# Altium schematic sheet DB10011_Converter.SchDoc: Power converters
size A3; Engineer: Danny Bokma; Revision: V0.3; SheetNumber: 3; SheetTotal: 7
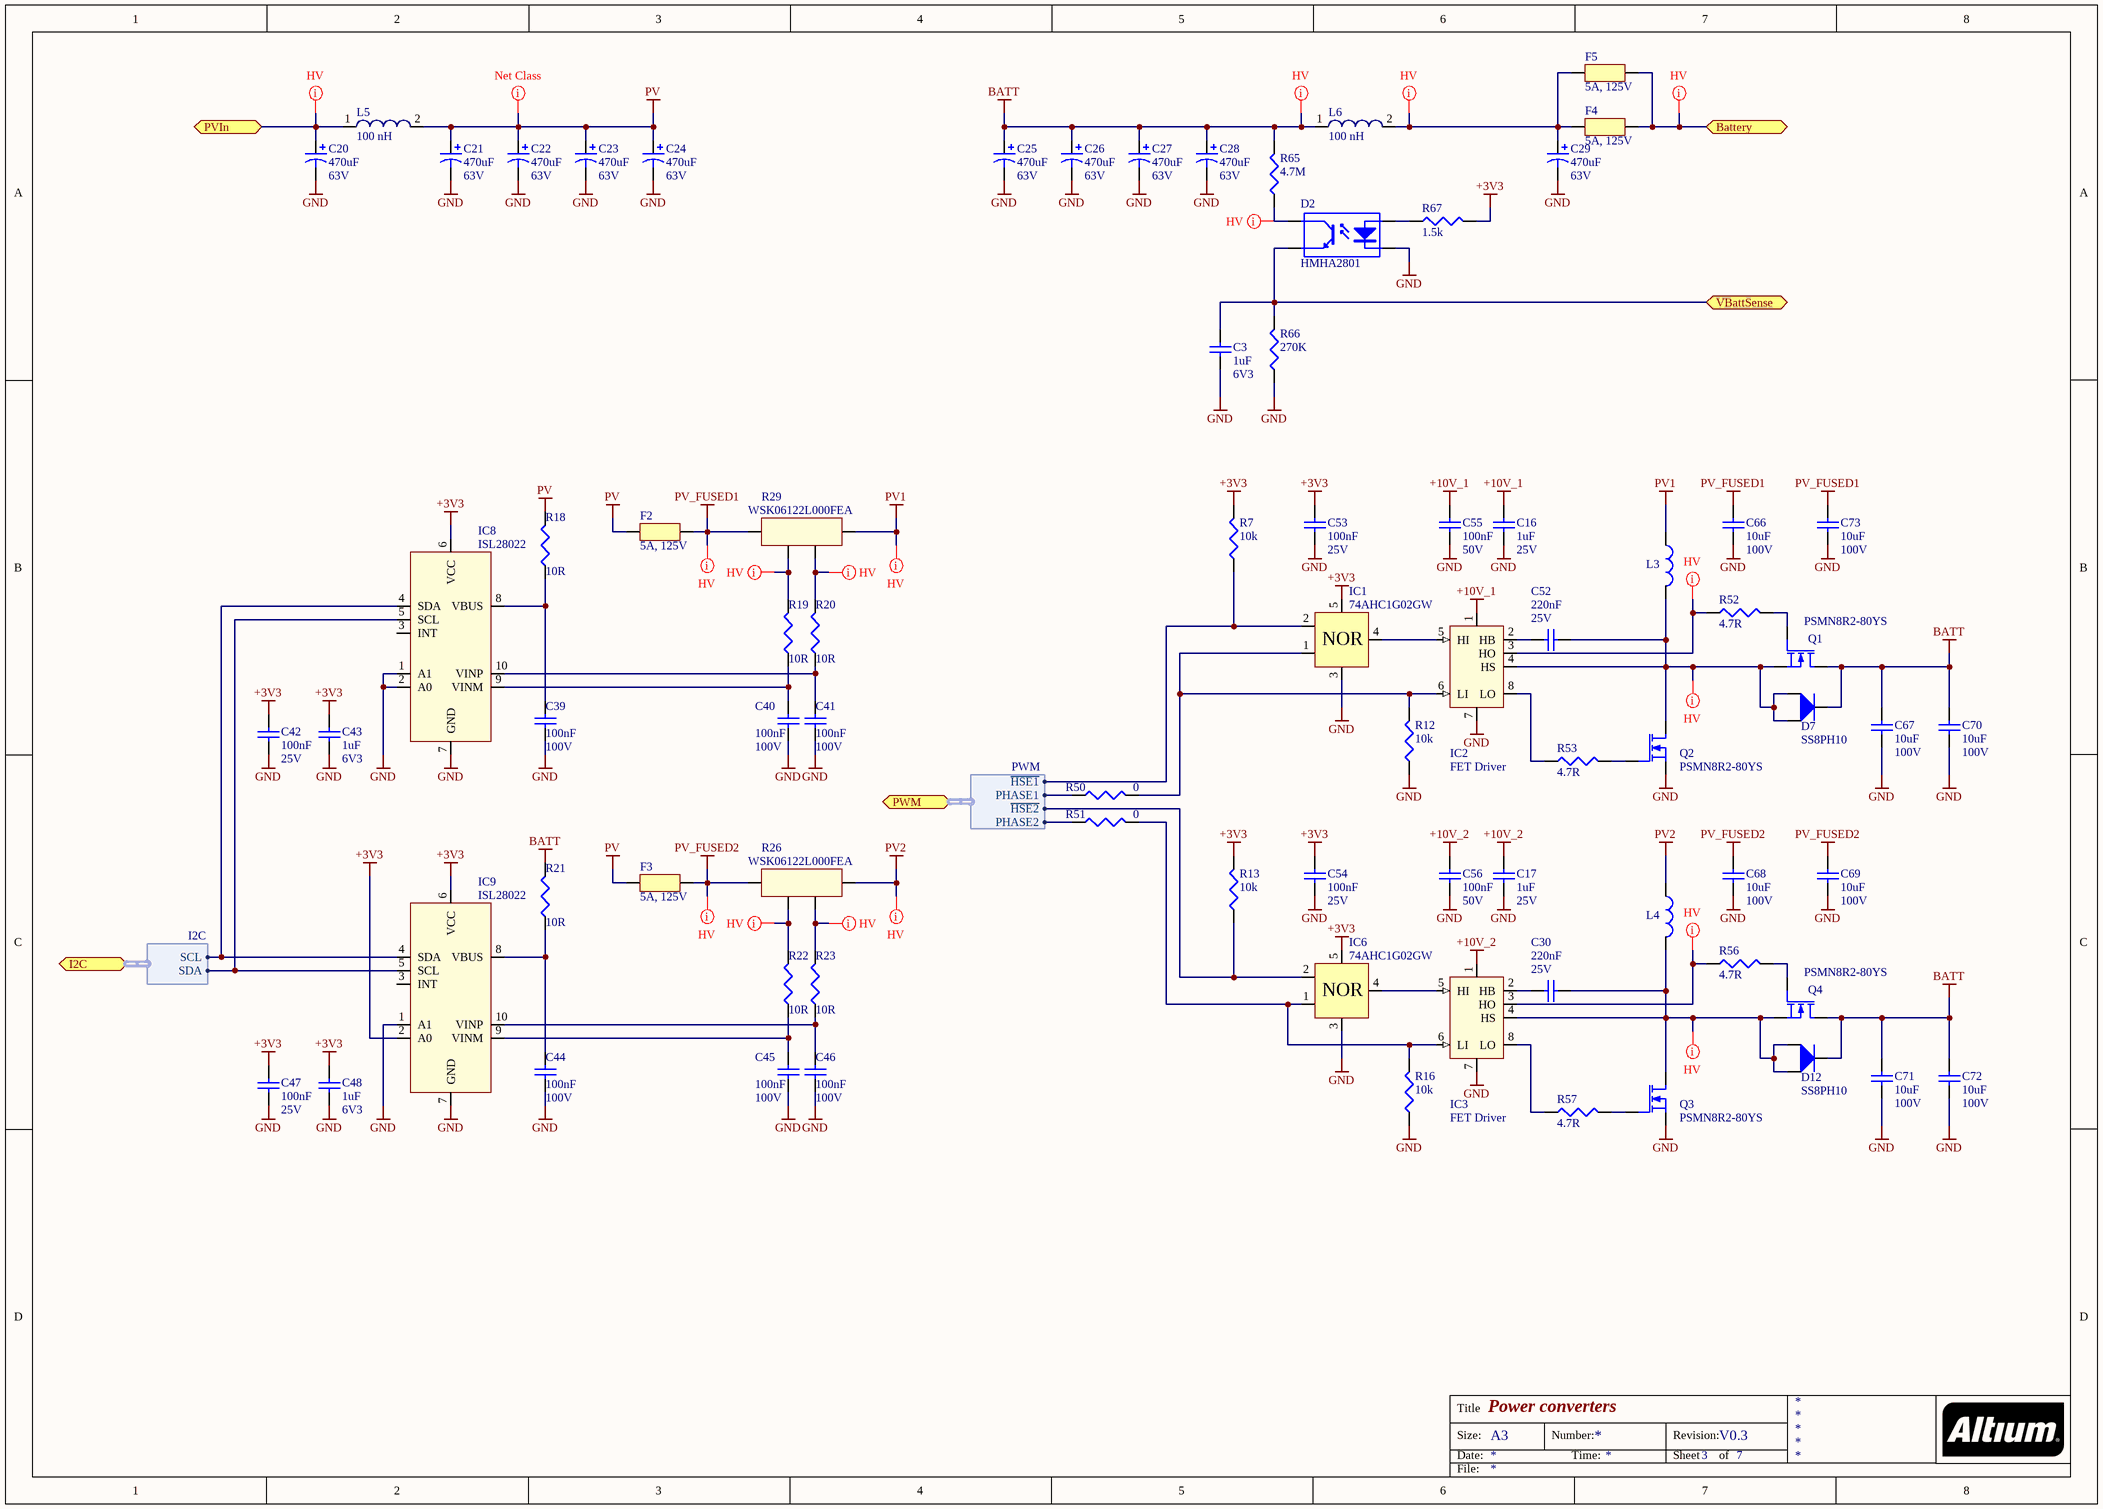
[diagram p0: DB10011_Converter.SchDoc]

## Parts
C3  1uF  Voltage Rating: 6V3  [C0402]
C16  1uF  Voltage Rating: 25V  [C0603]
C17  1uF  Voltage Rating: 25V  [C0603]
C20  470uF  Voltage Rating: 63V  [Radial-16]
C21  470uF  Voltage Rating: 63V  [Radial-16]
C22  470uF  Voltage Rating: 63V  [Radial-16]
C23  470uF  Voltage Rating: 63V  [Radial-16]
C24  470uF  Voltage Rating: 63V  [Radial-16]
C25  470uF  Voltage Rating: 63V  [Radial-16]
C26  470uF  Voltage Rating: 63V  [Radial-16]
C27  470uF  Voltage Rating: 63V  [Radial-16]
C28  470uF  Voltage Rating: 63V  [Radial-16]
C29  470uF  Voltage Rating: 63V  [Radial-16]
C30  220nF  Voltage Rating: 25V  [C0603]
C39  100nF  Voltage Rating: 100V  [C-0805]
C40  100nF  Voltage Rating: 100V  [C-0805]
C41  100nF  Voltage Rating: 100V  [C-0805]
C42  100nF  Voltage Rating: 25V  [C0402]
C43  1uF  Voltage Rating: 6V3  [C0402]
C44  100nF  Voltage Rating: 100V  [C-0805]
C45  100nF  Voltage Rating: 100V  [C-0805]
C46  100nF  Voltage Rating: 100V  [C-0805]
C47  100nF  Voltage Rating: 25V  [C0402]
C48  1uF  Voltage Rating: 6V3  [C0402]
C52  220nF  Voltage Rating: 25V  [C0603]
C53  100nF  Voltage Rating: 25V  [C0402]
C54  100nF  Voltage Rating: 25V  [C0402]
C55  100nF  Voltage Rating: 50V  [C0603]
C56  100nF  Voltage Rating: 50V  [C0603]
C66  10uF  Voltage Rating: 100V  [C2220]
C67  10uF  Voltage Rating: 100V  [C2220]
C68  10uF  Voltage Rating: 100V  [C2220]
C69  10uF  Voltage Rating: 100V  [C2220]
C70  10uF  Voltage Rating: 100V  [C2220]
C71  10uF  Voltage Rating: 100V  [C2220]
C72  10uF  Voltage Rating: 100V  [C2220]
C73  10uF  Voltage Rating: 100V  [C2220]
D2  HMHA2801  [FSOP4]
D7  SS8PH10  [TO277A]
D12  SS8PH10  [TO277A]
F2  5A, 125V  [SMF]
F3  5A, 125V  [SMF]
F4  5A, 125V  [SMF]
F5  5A, 125V  [SMF]
IC1  74AHC1G02GW  [SOT-23-5]
IC2  FET Driver  [SO-8]
IC3  FET Driver  [SO-8]
IC6  74AHC1G02GW  [SOT-23-5]
IC8  ISL28022  [MSOP10]
IC9  ISL28022  [MSOP10]
L3  ETD39Custom  [ETD39]  (value not drawn)
L4  ETD39Custom  [ETD39]  (value not drawn)
L5  100 nH  [WE-HCM 1240]
L6  100 nH  [WE-HCM 1240]
Q1  PSMN8R2-80YS  [SOT-669]
Q2  PSMN8R2-80YS  [SOT-669]
Q3  PSMN8R2-80YS  [SOT-669]
Q4  PSMN8R2-80YS  [SOT-669]
R7  10k  [0402]
R12  10k  [0402]
R13  10k  [0402]
R16  10k  [0402]
R18  10R  [0603]
R19  10R  [0603]
R20  10R  [0603]
R21  10R  [0603]
R22  10R  [0603]
R23  10R  [0603]
R26  WSK06122L000FEA  [WSK0612]
R29  WSK06122L000FEA  [WSK0612]
R50  0  [0402]
R51  0  [0402]
R52  4.7R  [0603]
R53  4.7R  [0603]
R56  4.7R  [0603]
R57  4.7R  [0603]
R65  4.7M  [0805]
R66  270K  [0402]
R67  1.5k  [0402]

## Ports
Battery, I2C (harness I2C), PVIn, PWM (harness PWM), VBattSense

## Harnesses
PWM: PHASE2, PHASE1, ~{HSE1}, ~{HSE2}
I2C: SDA, SCL

## Nets
+3V3: C42.2 C43.2 C47.2 C48.2 C53.1 C54.1 IC1.5(VCC) IC6.5(VCC) IC8.6(VCC) IC9.2(A0) IC9.6(VCC) R7.2 R13.2 R67.2
+10V_1: C16.2 C55.1 IC2.1(VDD)
+10V_2: C17.2 C56.1 IC3.1(VDD)
BATT: C25.1 C26.1 C27.1 C28.1 C67.2 C70.2 C71.2 C72.2 D7.K D12.K L6.1 Q1.D Q4.D R21.2 R65.2
GND: C3.1 C16.1 C17.1 C20.2 C21.2 C22.2 C23.2 C24.2 C25.2 C26.2 C27.2 C28.2 C29.2 C39.1 C40.1 C41.1 C42.1 C43.1 C44.1 C45.1 C46.1 C47.1 C48.1 C53.2 C54.2 C55.2 C56.2 C66.1 C67.1 C68.1 C69.1 C70.1 C71.1 C72.1 C73.1 D2.2(K1) IC1.3(GND) IC2.7(VSS) IC3.7(VSS) IC6.3(GND) IC8.1(A1) IC8.2(A0) IC8.7(GND) IC9.1(A1) IC9.7(GND) Q2.S Q3.S R12.1 R16.1 R66.1
PV: C21.1 C22.1 C23.1 C24.1 F2.1 F3.1 L5.2 R18.2
PV1: L3.1 R29.a
PV2: L4.1 R26.a
PV_FUSED1: C66.2 C73.2 F2.2 R29.b
PV_FUSED2: C68.2 C69.2 F3.2 R26.b
Battery: F4.2 F5.2 ; port Battery
PVIn: C20.1 L5.1 ; port PVIn
VBattSense: C3.2 D2.3(E1) R66.2 ; port VBattSense
NetC29_1: C29.1 F4.1 F5.1 L6.2
NetC30_1: C30.1 D12.1(A) D12.2(A) IC3.4(HS) L4.2 Q3.D Q4.S
NetC30_2: C30.2 IC3.2(HB)
NetC39_2: C39.2 IC8.8(VBUS) R18.1
NetC40_2: C40.2 IC8.9(VINM) R19.1
NetC41_2: C41.2 IC8.10(VINP) R20.1
NetC44_2: C44.2 IC9.8(VBUS) R21.1
NetC45_2: C45.2 IC9.9(VINM) R22.1
NetC46_2: C46.2 IC9.10(VINP) R23.1
NetC52_1: C52.1 D7.1(A) D7.2(A) IC2.4(HS) L3.2 Q1.S Q2.D
NetC52_2: C52.2 IC2.2(HB)
NetD2_1: D2.1(A1) R67.1
NetD2_4: D2.4(C1) R65.1
NetIC1_1: IC1.1(B) IC2.6(LI) R12.2 R50.2
NetIC1_2: IC1.2(A) R7.1 ; port PWM.~{HSE1}
NetIC1_4: IC1.4(Y) IC2.5(HI)
NetIC2_3: IC2.3(HO) R52.1
NetIC2_8: IC2.8(LO) R53.1
NetIC3_3: IC3.3(HO) R56.1
NetIC3_5: IC3.5(HI) IC6.4(Y)
NetIC3_6: IC3.6(LI) IC6.1(B) R16.2 R51.2
NetIC3_8: IC3.8(LO) R57.1
NetIC6_2: IC6.2(A) R13.1 ; port PWM.~{HSE2}
NetIC8_4: IC8.4(SDA) IC9.4(SDA) ; port I2C.SCL
NetIC8_5: IC8.5(SCL) IC9.5(SCL) ; port I2C.SDA
NetQ1_G: Q1.G R52.2
NetQ2_G: Q2.G R53.2
NetQ3_G: Q3.G R57.2
NetQ4_G: Q4.G R56.2
NetR19_2: R19.2 R29.bs
NetR20_2: R20.2 R29.as
NetR22_2: R22.2 R26.bs
NetR23_2: R23.2 R26.as
NetR50_1: R50.1 ; port PWM.PHASE1
NetR51_1: R51.1 ; port PWM.PHASE2

Not connected (* = marked no-connect by the designer): IC8 3(INT); IC9 3(INT)

## Layout directives
net class 0.5mm: BATT, Battery, NetC29_1, NetC30_1, NetC52_1, NetD2_4, NetIC2_3, NetIC3_3, NetR19_2, NetR20_2, NetR22_2, NetR23_2, PV, PV1, PV2, PV_FUSED1, PV_FUSED2, PVIn

## Notes on the sheet
- Title
- Size:
- Date:
- A3
- Number:
- Time:
- Revision:
- Sheet
- of
- File:
- (in symbol 74AHC1G02GW) NOR

## Library data of the parts
C3 C43 C48 = 1uF/0402/CER/6.3V: Capacitor, 1uF, 6.3V, X5R; Capacitance Tolerance: ± 10%; Capacitor Case Style: 0402; Brand Number: 04026D105KAT2A; Brand: AVX; Dielectric Characteristic: X5R; Capacitance: 1uF; Temperature Range: -55°C to +85°C; Price: 0,0874; Order Code Supplier: 1327658; Supplier: Farnell
C16 C17 = 1uF/0603/CER/25V: Capacitor, 1uF, 25V, X7R; Capacitance Tolerance: ± 10%; Capacitor Case Style: 0603; Brand Number: GRM188R71E105KA12D; Brand: MURATA; Dielectric Characteristic: X7R; Capacitance: 1uF; Temperature Range: -55°C to +125°C; Price: 0,186; Order Code Supplier: 1735540; Supplier: Farnell
C20-C29 = 470uF/ALU/63V: Aluminum Electrolytic Capacitor, 470uF, 63V; Capacitance Tolerance: ± 20%; Capacitor Case Style: Radial Leaded 16; Brand Number: 63ZL470MEFC16X20; Brand: RUBYCON; Dielectric Characteristic: *; Capacitance: 470uF; Temperature Range: -40°C to +105°C; Price: 1,23; Order Code Supplier: 1281841; Supplier: Farnell
C30 C52 = 220nF/0603/CER/25V: Capacitor, 220nF, 25V, X7R; Capacitance Tolerance: ± 10%; Capacitor Case Style: 0603; Brand Number: 06033C224KAT2A; Brand: AVX; Dielectric Characteristic: X7R; Capacitance: 220nF; Temperature Range: -55°C to +125°C; Price: 0,111; Order Code Supplier: 1833865; Supplier: Farnell
C39-C41 C44-C46 = 100nF/0805/CER/100V: Capacitor, 100nF, 100V, X7R; Capacitance Tolerance: ± 10%; Capacitor Case Style: 0805; Brand Number: C0805C104K1RACTU; Brand: KEMET; Dielectric Characteristic: X7R; Capacitance: 100nF; Temperature Range: -55°C to +125°C; Price: 0,096; Order Code Supplier: 1650862; Supplier: Farnell
C42 C47 C53 C54 = 100nF/0402/CER/25V: Capacitor, 100nF, 25V, X7R; Capacitance Tolerance: 10nF; Capacitor Case Style: 0402; Brand Number: GRM155R71E104KE14D; Brand: MULTICOMP; Dielectric Characteristic: X7R; Capacitance: 100nF; Temperature Range: -55 to +125 C; Price: 0,0225; Order Code Supplier: 2456106; Supplier: Farnell
C55 C56 = 100nF/0603/CER/50V: Capacitor, 100nF, 50V, X7R; Capacitance Tolerance: ± 10%; Capacitor Case Style: 0603; Brand Number: MCCA000255; Brand: MULTICOMP; Dielectric Characteristic: X7R; Capacitance: 100nF; Temperature Range: -55°C to +125°C; Price: 0,008; Order Code Supplier: 1759122RL; Supplier: Farnell
C66-C73 = 10uF/2220/CER/100V: Capacitor, 10uF, 100V, X7S; Capacitance Tolerance: 20%; Capacitor Case Style: 2220; Brand Number: C5750X7S2A106M230KB; Brand: TDK; Dielectric Characteristic: X7S; Capacitance: 10uF; Temperature Range: *; Price: 1,77; Order Code Supplier: 2112740; Supplier: Farnell
D2 = HMHA2801: Optocoupler, Vout:80V, Iin:0.01A; Brand: FAIRCHILD SEMICONDUCTOR; Isolation Voltage: 2500V; Input Current: 0.01A; Output Voltage: 80V; Brand Number: HMHA2801; Case Style: *; Price: 0,28; Order Code Supplier: 1652504; Supplier: Farnell; Temperature Range: -55°C to +100°C
D7 D12 = SS8PH10: Diode 8A 100V; Brand Number: SS8PH10-M3/86A; Brand: VISHAY GENERAL; Supplier: Farnell; Case Style: TO277A; Price: 1,12; Order Code Supplier: 2335175
F2-F5 = 0452005.MRL: Fuse, Slow Blow, 5A, 125V, T:-55°C +125°C; Brand: LITTELFUSE; Case Style: SMD; Brand Number: 0452005.MRL; Price: 0,69; Order Code Supplier: 9922415; Supplier: Farnell
IC1 IC6 = 74AHC1G02GW: LOGIC, NOR Gate 2-Input; Case Style: SOT23-5; Brand Number: SN74AHC1G02DBVR; Brand: NXP; Supplier: Farnell; Price: 0,294; Order Code Supplier: 1287441
IC2 IC3 = UCC27211: Half bridge FET driver; Case Style: SOIC8; Brand Number: UCC27211DDA; Brand: TI; Supplier: Farnell; Price: 3,51; Order Code Supplier: 2099940
IC8 IC9 = ISL28022: Current and voltage ADC; Brand Number: ISL28022FUZ; Brand: Intersil; Supplier: Farnell; Case Style: MSOP10; Price: 3,44; Order Code Supplier: 2373594
L3 L4 = ETD39Custom: Custom inductor for MPPT; Manufacturer: FERROXCUBE; Order Code Manufacturer: CPH-ETD39-1S-16P-C; Supplier: Farnell; Order Code Supplier: 3056314; Price: 2,35
L5 L6 = WE-HCM 1240, 744304010: SMD Flat Wire Inductor WE-HCM Hight Current, L=100 nH; partNo: 744304010; Inductance: 100 nH; ComponentLink1Description: Manufacturer; ComponentLink1URL: http://www.we-online.de; Created by: Christin Zierenner; Created Date: August 2010; ComponentLink2URL: http://katalog.we-online.de/kataloge/eisos/media/pdf/744304010.pdf; ComponentLink2Description: Datasheet
Q1-Q4 = PSMN8R2-80YS: Mosfet, N-channel, Vds:80V, Id:82A, Vgs-th:4V, Rds-on:0.0058ohm; Brand: NXP; Drain Current: 82A; Drain Source Voltage: 80V; Gate Source Voltage: 20V; Threshold Voltage: 4V; Brand Number: PSMN8R2-80YS; Case Style: SOT-669; On Resistance: 0.0058ohm; Order Code Supplier: 1785646; Price: 1,39; Supplier: Farnell; Temperature Range: -55°C to +175°C; Transistor Polarity: N-channel
R7 R12 R13 R16 = 10k/0402/0063W/50V: Resistor, 10k, 0.1%, 0.0625W, 50V, 100PPM, 0402; Brand: VISHAY DRALORIC; Brand Number: CRCW040210K0FKED; Power Rating: 0.063W; Case Style: 0402; Order Code Supplier: 2121730; Price: 0,0005; Resistance: 10k; Supplier: Farnell; Temperature Coefficient: ± 100PPM; Temperature Range: -55°C to +125°C; Voltage Rating: 50V
R18-R23 = 10/0603/0063W/50V: Resistor, 10R, 1%, 0.063W, 50V, 200PPM, 0603; Brand: VISHAY DRALORIC; Brand Number: CRCW060310R0FKEA; Case Style: 0603; Order Code Supplier: 2122113; Power Rating: 0.063W; Price: 0,038; Resistance: 10R; Supplier: Farnell; Temperature Coefficient: ± 200PPM; Temperature Range: -55°C to +125°C; Voltage Rating: 50V
R26 R29 = WSK06122L000FEA: RES, METAL STRIP, 0.002OHM, 1%; Case Style: 0612; Brand: VISHAY; Supplier: Farnell; Price: 0,488; Order Code Supplier: 2420726; Brand Number: WSK06122L000FEA
R50 R51 = 0/0402/0063W/50V: Resistor, 0, 0.1%, 0.0625W, 50V, 100PPM, 0402; Brand: VISHAY DRALORIC; Brand Number: CRCW04020000Z0ED; Power Rating: 0.063W; Case Style: 0402; Order Code Supplier: 2121349; Price: 0,0021; Resistance: 0; Supplier: Farnell; Temperature Coefficient: ± 100PPM; Temperature Range: -55°C to +125°C; Voltage Rating: 50V
R52 R53 R56 R57 = 4.7/0603/0063W/50V: Resistor, 4.7R, 1%, 0.063W, 50V, 200PPM, 0603; Brand: VISHAY DALE; Brand Number: CRCW06034R70FKEA; Case Style: 0603; Order Code Supplier: 2371579; Power Rating: 0.063W; Price: 0,038; Resistance: 4.7R; Supplier: Farnell; Temperature Coefficient: ± 200PPM; Temperature Range: -55°C to +125°C; Voltage Rating: 50V
R65 = 4.7M/0805/0250W/150V: Resistor, 4.7M, 1%, 0.25W, 150V, 100PPM, 0805; Brand: MULTICOMP; Brand Number: MCHP05W4F4704T5E; Case Style: 0805; Order Code Supplier: 1576516; Power Rating: 0.25W; Price: 0,089; Resistance: 4.7M; Supplier: Farnell; Temperature Coefficient: ± 100PPM; Temperature Range: -55°C to +155°C; Voltage Rating: 150V
R66 = 270k/0402/0063W/50V: Resistor, 270k, 0.1%, 0.0625W, 50V, 100PPM, 0402; Brand: Panasonic; Brand Number: ERJ2GEJ274X; Power Rating: 0.063W; Case Style: 0402; Order Code Supplier: 2324291; Price: 0,0148; Resistance: 270K; Supplier: Farnell; Temperature Coefficient: ± 100PPM; Temperature Range: -55°C to +125°C; Voltage Rating: 50V
R67 = 1.5k/0402/0063W/50V: Resistor, 1.5k, 0.1%, 0.0625W, 50V, 100PPM, 0402; Brand: VISHAY DRALORIC; Brand Number: CRCW04021K50FKED; Power Rating: 0.063W; Case Style: 0402; Order Code Supplier: 2121624; Price: 0,0054; Resistance: 1.5k; Supplier: Farnell; Temperature Coefficient: ± 100PPM; Temperature Range: -55°C to +125°C; Voltage Rating: 50V